# Altium schematic sheet 4GModule-EC2X.SchDoc
size A2
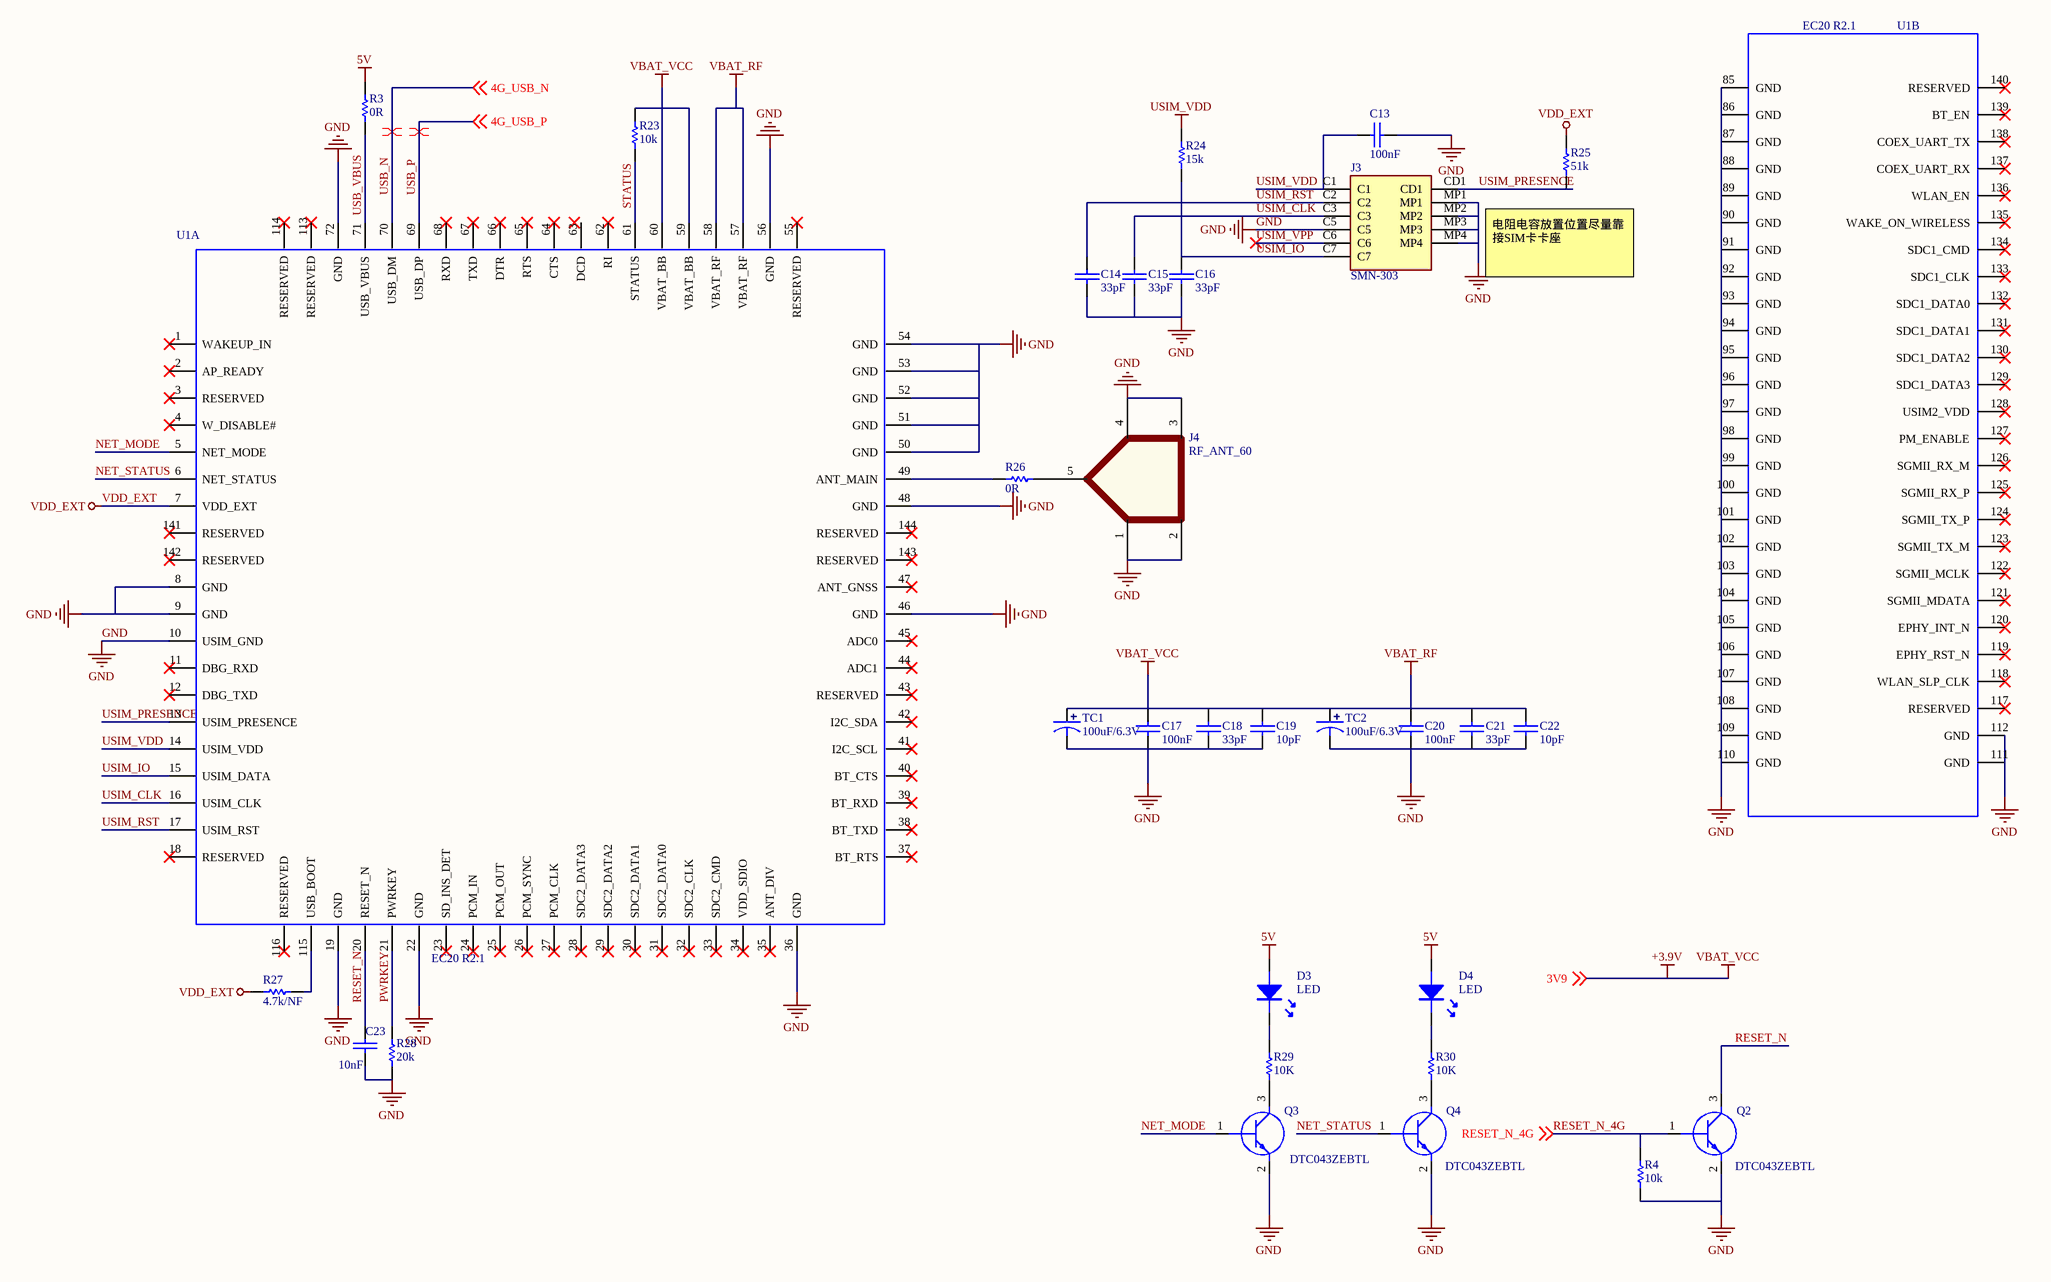
[diagram p0: 4GModule-EC2X.SchDoc]

## Parts
C13  100nF  [0402C]
C14  33pF  [0402C]
C15  33pF  [0402C]
C16  33pF  [0402C]
C17  100nF  [0402C]
C18  33pF  [0402C]
C19  10pF  [0402C]
C20  100nF  [0402C]
C21  33pF  [0402C]
C22  10pF  [0402C]
C23  10nF  [0402C]
D3  LED  [LED-0603W]
D4  LED  [LED-0603B]
J3  SMN-303  [SMN303]
J4  RF_ANT_60  [SMA-EDGE]
Q2  DTC043ZEBTL  [SOTFL50P160X85-3N]
Q3  DTC043ZEBTL  [SOTFL50P160X85-3N]
Q4  DTC043ZEBTL  [SOTFL50P160X85-3N]
R3  0R  [0402R]
R4  10k  [0402R]
R23  10k  [0402R]
R24  15k  [0402R]
R25  51k  [0402R]
R26  0R  [0402R]
R27  4.7k/NF  [0402R]
R28  20k  [0402R]
R29  10K  [0402R]
R30  10K  [0402R]
TC1  100uF/6.3V  [TAJ-B/3528]
TC2  100uF/6.3V  [TAJ-B/3528]
U1  EC20 R2.1  [EC20_R2.1]  (parts A,B of 2)

## Nets
5V: D3.A D4.A R3.2
+3.9V: C17.2 C18.2 C19.2 C20.2 C21.2 C22.2 R23.2 TC1.1 TC2.1 U1.57(VBAT_RF) U1.58(VBAT_RF) U1.59(VBAT_BB) U1.60(VBAT_BB) ; off-sheet 3V9  [also labelled 3V9, VBAT_RF, VBAT_VCC]
GND: C13.1 C14.1 C15.1 C16.1 C17.1 C18.1 C19.1 C20.1 C21.1 C22.1 C23.1 J3.C5 J3.MP1 J3.MP2 J3.MP3 J3.MP4 J4.1 J4.2 J4.3 J4.4 Q2.2(E) Q3.2(E) Q4.2(E) R4.1 R28.1 TC1.2 TC2.2 U1.8(GND) U1.9(GND) U1.10(USIM_GND) U1.19(GND) U1.22(GND) U1.36(GND) U1.46(GND) U1.48(GND) U1.50(GND) U1.51(GND) U1.52(GND) U1.53(GND) U1.54(GND) U1.56(GND) U1.72(GND) U1.85(GND) U1.86(GND) U1.87(GND) U1.88(GND) U1.89(GND) U1.90(GND) U1.91(GND) U1.92(GND) U1.93(GND) U1.94(GND) U1.95(GND) U1.96(GND) U1.97(GND) U1.98(GND) U1.99(GND) U1.100(GND) U1.101(GND) U1.102(GND) U1.103(GND) U1.104(GND) U1.105(GND) U1.106(GND) U1.107(GND) U1.108(GND) U1.109(GND) U1.110(GND) U1.111(GND) U1.112(GND)
USIM_VDD: C13.2 J3.C1 R24.2 U1.14(USIM_VDD)
VDD_EXT: R25.2 R27.2 U1.7(VDD_EXT)
NET_MODE: Q3.1(B) U1.5(NET_MODE)
NET_STATUS: Q4.1(B) U1.6(NET_STATUS)
PWRKEY: R28.2 U1.21(PWRKEY)
RESET_N: C23.2 Q2.3(C) U1.20(RESET_N)
RESET_N_4G: Q2.1(B) R4.2 ; off-sheet RESET_N_4G
STATUS: R23.1 U1.61(STATUS)
USB_N: U1.70(USB_DM) ; off-sheet 4G_USB_N  [also labelled 4G_USB_N]
USB_P: U1.69(USB_DP) ; off-sheet 4G_USB_P  [also labelled 4G_USB_P]
USB_VBUS: R3.1 U1.71(USB_VBUS)
USIM_CLK: C15.2 J3.C3 U1.16(USIM_CLK)
USIM_IO: C16.2 J3.C7 R24.1 U1.15(USIM_DATA)
USIM_PRESENCE: J3.CD1 R25.1 U1.13(USIM_PRESENCE)
USIM_RST: C14.2 J3.C2 U1.17(USIM_RST)
USIM_VPP: J3.C6
NetD3_K: D3.K R29.2
NetD4_K: D4.K R30.2
NetJ4_5: J4.5 R26.2
NetQ3_3: Q3.3(C) R29.1
NetQ4_3: Q4.3(C) R30.1
NetR26_1: R26.1 U1.49(ANT_MAIN)
NetR27_1: R27.1 U1.115(USB_BOOT)

Not connected (* = marked no-connect by the designer): U1 1(WAKEUP_IN)* 2(AP_READY)* 3(RESERVED)* 4(W_DISABLE#)* 11(DBG_RXD)* 12(DBG_TXD)* 18(RESERVED)* 23(SD_INS_DET)* 24(PCM_IN)* 25(PCM_OUT)* 26(PCM_SYNC)* 27(PCM_CLK)* 28(SDC2_DATA3)* 29(SDC2_DATA2)* 30(SDC2_DATA1)* 31(SDC2_DATA0)* 32(SDC2_CLK)* 33(SDC2_CMD)* 34(VDD_SDIO)* 35(ANT_DIV)* 37(BT_RTS)* 38(BT_TXD)* 39(BT_RXD)* 40(BT_CTS)* 41(I2C_SCL)* 42(I2C_SDA)* 43(RESERVED)* 44(ADC1)* 45(ADC0)* 47(ANT_GNSS)* 55(RESERVED)* 62(RI)* 63(DCD) 64(CTS)* 65(RTS)* 66(DTR)* 67(TXD)* 68(RXD)* 113(RESERVED)* 114(RESERVED)* 116(RESERVED)* 117(RESERVED)* 118(WLAN_SLP_CLK)* 119(EPHY_RST_N)* 120(EPHY_INT_N)* 121(SGMII_MDATA)* 122(SGMII_MCLK)* 123(SGMII_TX_M)* 124(SGMII_TX_P)* 125(SGMII_RX_P)* 126(SGMII_RX_M)* 127(PM_ENABLE)* 128(USIM2_VDD)* 129(SDC1_DATA3)* 130(SDC1_DATA2)* 131(SDC1_DATA1)* 132(SDC1_DATA0)* 133(SDC1_CLK)* 134(SDC1_CMD)* 135(WAKE_ON_WIRELESS)* 136(WLAN_EN)* 137(COEX_UART_RX)* 138(COEX_UART_TX)* 139(BT_EN)* 140(RESERVED)* 141(RESERVED)* 142(RESERVED)* 143(RESERVED)* 144(RESERVED)*

## Layout directives
differential pair: USB_N, USB_P

## Notes on the sheet
- 电阻电容放置位置尽量靠接SIM卡卡座

## Library data of the parts
C13-C16 = CAP: 无极性电容
C17-C23 = CAP-NP
D3 = LED: 白色
D4 = LED: 蓝色
J3 = SMN-303: 自弹式NANO SIM卡座 XUNPU(讯普); Datasheet Link: https://datasheet.lcsc.com/szlcsc/XUNPU-SMN-303_C266888.pdf; Height: 1.47mm; Manufacturer_Name: XUNPU; Manufacturer_Part_Number: SMN-303
Q2-Q4 = DTC043ZEBTL: Transistor BJT NPN; Manufacturer_Name: ROHM Semiconductor; Datasheet Link: http://rohmfs.rohm.com/en/products/databook/datasheet/discrete/transistor/digital/dtc043zmt2l-e.pdf; Height: 0.85mm; Manufacturer_Part_Number: DTC043ZEBTL; Arrow Part Number: DTC043ZEBTL; Mouser Part Number: 755-DTC043ZEBTL; Mouser Price/Stock: https://www.mouser.co.uk/ProductDetail/ROHM-Semiconductor/DTC043ZEBTL?qs=n7vHx8wJlDGyWrBOh0icRQ%3D%3D
R3 R4 R23-R30 = RES
TC1 TC2 = TCAP
U1 = EC20 R2.1: Value: *; Part Description: *; PCB DECAL: *